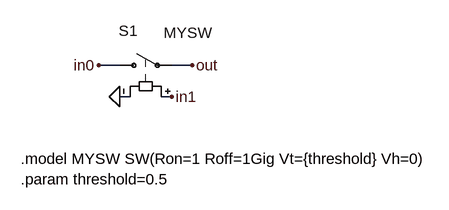
[diagram p0: schematic switch.asc]
switch.asc, the LTspice schematic file:
Version 4
SHEET 1 880 680
WIRE 192 -112 160 -112
WIRE 304 -112 272 -112
WIRE 208 -64 192 -64
WIRE 272 -64 256 -64
FLAG 160 -112 in0
FLAG 304 -112 out
FLAG 192 -64 0
FLAG 272 -64 in1
SYMBOL sw 176 -112 R270
WINDOW 0 53 15 VRight 2
WINDOW 3 50 84 VRight 2
SYMATTR InstName S1
SYMATTR Value MYSW
TEXT 40 32 Left 2 !.model MYSW SW(Ron=1 Roff=1Gig Vt={threshold} Vh=0)\n.param threshold=0.5

The netlist it stands for:
* switch.asc
S1 in0 out in1 0 MYSW
.model MYSW SW(Ron=1 Roff=1Gig Vt={threshold} Vh=0)
.param threshold=0.5
.backanno
.end